# Altium schematic sheet amp.SchDoc
size A
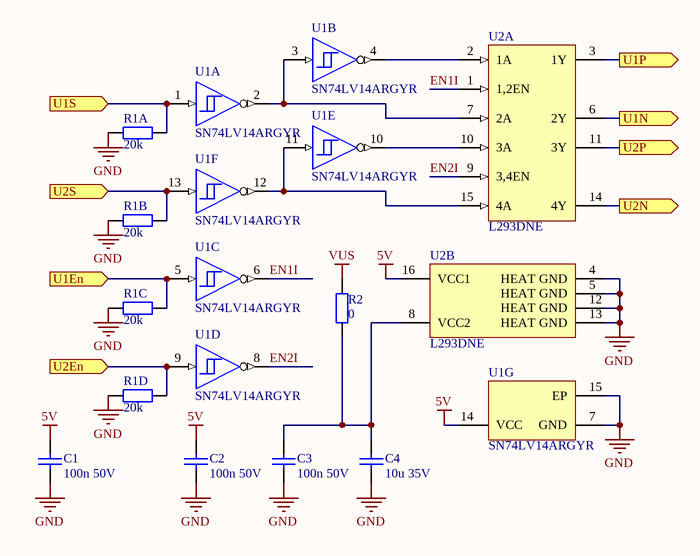
[diagram p0: amp.SchDoc]

## Parts
C1  100n 50V  [C-0603-M]
C2  100n 50V  [C-0603-M]
C3  100n 50V  [C-0603-M]
C4  10u 35V  [C-0805-M]
R1  20k  [CAC-50P200X100-8N]  (parts A,B,C,D of 4)
R2  0  [R-0603-M]
U1  SN74LV14ARGYR  [RGY0014A_V]  (parts A,B,C,D,E,F,G of 7)
U2  L293DNE  [NE0016A]  (parts A,B of 2)

## Ports
U1En (in), U1N (out), U1P (out), U1S (in), U2En (in), U2N (out), U2P (out), U2S (in)

## Nets
5V: C1.2 C2.2 U1.14(VCC) U2.16(VCC1)
GND: C1.1 C2.1 C3.1 C4.1 R1.1 R1.2 R1.3 R1.4 U1.7(GND) U1.15(EP) U2.4(HEAT_GND) U2.5(HEAT_GND) U2.12(HEAT_GND) U2.13(HEAT_GND)
VUS: R2.2
EN1I: U1.6(~{3Y}) U2.1(1,2EN)
EN2I: U1.8(~{4Y}) U2.9(3,4EN)
U1En: R1.6 U1.5(3A) ; port U1En
U1N: U2.6(2Y) ; port U1N
U1P: U2.3(1Y) ; port U1P
U1S: R1.8 U1.1(1A) ; port U1S
U2En: R1.5 U1.9(4A) ; port U2En
U2N: U2.14(4Y) ; port U2N
U2P: U2.11(3Y) ; port U2P
U2S: R1.7 U1.13(6A) ; port U2S
NetC3_2: C3.2 C4.2 R2.1 U2.8(VCC2)
NetU1_2: U1.2(~{1Y}) U1.3(2A) U2.7(2A)
NetU1_4: U1.4(~{2Y}) U2.2(1A)
NetU1_10: U1.10(~{5Y}) U2.10(3A)
NetU1_11: U1.11(5A) U1.12(~{6Y}) U2.15(4A)

## Library data of the parts
C1-C3 = C-0603-100n-50V: Capacitor 100n 50V; Supplier 1: Mouser; Supplier Part Number 1: 80-C0603C104K5RAUTO
C4 = C-0805-10u-25V: 3; Supplier 1: Mouser; Supplier Part Number 1: 80-C0805C106K3P
R1 = R-4x20k: Resistor Array 4x20k; Supplier 1: Mouser; Supplier Part Number 1: 667-EXB-N8V203JX
R2 = R-0603-0: Resistor 0; Supplier 1: Mouser; Supplier Part Number 1: 71-CRCW0603-0-E3; Resistance: 0
U1 = CMP-1615-01171-4: Hex Schmitt-Trigger Inverters, RGY0014A, LARGE T&R; Manufacturer: Texas Instruments; Technology Family: LV-A; Schmitt Trigger: Yes; tpd @ Nom Voltage(Max)(ns): 27,18.5,12; Output Drive (IOL/IOH)(Max)(mA): -50/50; VCC(Min)(V): 2; Output Type: CMOS; Input Type: LVTTL; ICC @ Nom Voltage(Max)(mA): 0.02; F @ Nom Voltage(Max)(Mhz): 110; Rating: Catalog; VCC(Max)(V): 5.5; Voltage(Nom)(V): 2.5,3.3,5; Bits(#): 6; DatasheetVersion: SCLS386K; Generic Part Number: SN74LV14A; Operating Temperature Range(C): -40 to 125,-40 to 85; PackageReference: RGY0014A; Code_JEDEC: MO-241; PartId: 1
U2 = CMP-1685-00015-1: Quadruple Half-H Driver, 1.2 A Peak, 4.5 to 36 V, 0 to 70 degC, 16-Pin DIP (NE), Pb-Free (RoHS), Tube; Voltage Rating: 20 V; Tolerance: 10%; ESR: 800 mohm; Resistance: 0.8 Ohm; Capacitance: 22 uF; Packaging: Tape and Reel; PackageDescription: 16-Pin Through Hole Device, Body 19.8 x 6.35 mm, Pitch 2.54 mm, Row Spacing 7.62 mm; ComponentLink2URL: http://www.ti.com/general/docs/lit/getliterature.tsp?genericPartNumber=l293d&fileType=pdf; Case Code (Imperial): 2917; Max Operating Temperature: 125degC; Pins: 2; ComponentLink2Description: Datasheet; PackageVersion: 4040054/B, 04/1995; Radiation Hardening: No; Height: 3.1 mm; Mount: Surface Mount; ComponentLink3URL: http://www.ti.com/lit/ml/mpdi003/mpdi003.pdf; Width: 4.3 mm; Weight: 0.023634 oz; ComponentLink3Description: Package Specification; PackageReference: NE0016A; Length: 7.3 mm; Min Operating Temperature: -55degC; Case/Package: 2917; ComponentLink1Description: Manufacturer URL; Voltage Rating (DC): 20 V; DatasheetVersion: SLRS008D, 01/2016; Package Quantity: 500; RoHSCompliant: True; REACH SVHC: No SVHC; Code_JEDEC: MS-001; ComponentLink1URL: http://www.ti.com/; Case Code (Metric): 7343; PartId: 1